# Altium schematic sheet Ngu-nghiep.schdoc
size A
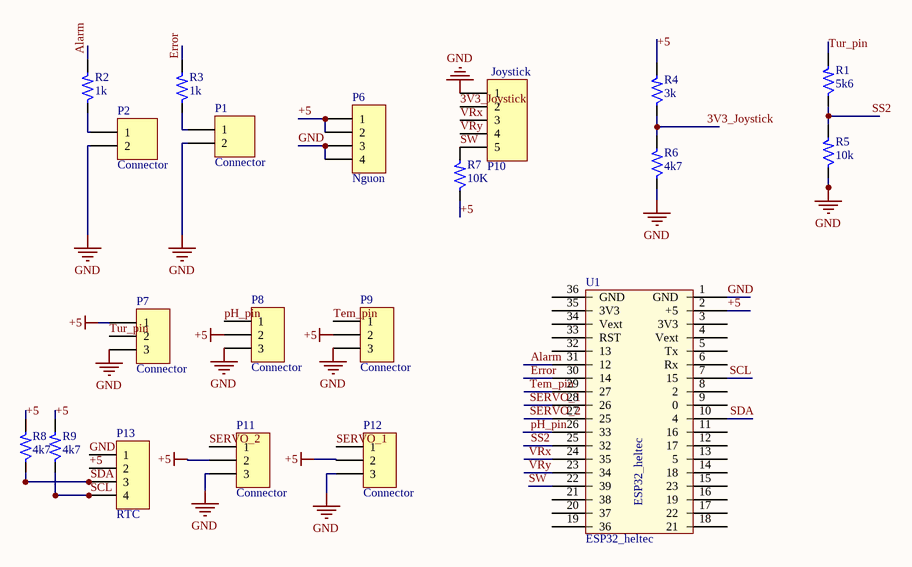
[diagram p0: Ngu-nghiep.schdoc]

## Parts
P1  Connector  [JST-XH_B2B-XH-A]
P2  Connector  [JST-XH_B2B-XH-A]
P6  Nguon  [JST-XH_B4B-XH-A]
P7  Connector  [JST-XH_B3B-XH-A]
P8  Connector  [JST-XH_B3B-XH-A]
P9  Connector  [JST-XH_B3B-XH-A]
P10  Joystick  [JST-XH_B5B-XH-A]
P11  Connector  [JST-XH_B3B-XH-A]
P12  Connector  [JST-XH_B3B-XH-A]
P13  RTC  [JST-XH_B4B-XH-A]
R1  5k6  [R1/8W]
R2  1k  [R1/8W]
R3  1k  [R1/8W]
R4  3k  [R1/8W]
R5  10k  [R1/8W]
R6  4k7  [R1/8W]
R7  10K  [R1/8W]
R8  4k7  [R1/8W]
R9  4k7  [R1/8W]
U1  ESP32_heltec  [ESP32_WFK_Heltec]

## Nets
+5: P6.1 P6.2 P7.1 P8.2 P9.2 P11.2 P12.2 P13.2 R4.2 R7.1 R8.2 R9.2 U1.2(+5)
GND: P1.2 P2.2 P6.3 P6.4 P7.3 P8.3 P9.3 P10.1 P11.3 P12.3 P13.1 R5.1 R6.1 U1.1(GND)
3V3_Joystick: P10.2 R4.1 R6.2
Alarm: R2.2 U1.31(12)
Error: R3.2 U1.30(14)
pH_pin: P8.1 U1.26(33)
SCL: P13.4 R9.1 U1.7(15)
SDA: P13.3 R8.1 U1.10(4)
SERVO_1: P12.1 U1.28(26)
SERVO_2: P11.1 U1.27(25)
SS2: R1.1 R5.2 U1.25(32)
SW: P10.5 R7.2 U1.22(39)
Tem_pin: P9.1 U1.29(27)
Tur_pin: P7.2 R1.2
VRx: P10.3 U1.24(35)
VRy: P10.4 U1.23(34)
NetP1_1: P1.1 R3.1
NetP2_1: P2.1 R2.1

Not connected (* = marked no-connect by the designer): U1 3(3V3) 4(Vext) 5(Tx) 6(Rx) 8(2) 9(0) 11(16) 12(17) 13(5) 14(18) 15(23) 16(19) 17(22) 18(21) 19(36) 20(37) 21(38) 32(13) 33(RST) 34(Vext) 35(3V3) 36(GND)

## Library data of the parts
P1 P2 = Connector_2pin
P6 P13 = Connector_4pin
P7-P9 P11 P12 = Connector_3pin
P10 = Connector_5pin
R1-R9 = R: Resistor 1/4W; Value: R1/4W - 1K
U1 = ESP32_heltec: ESP32 IOT kit